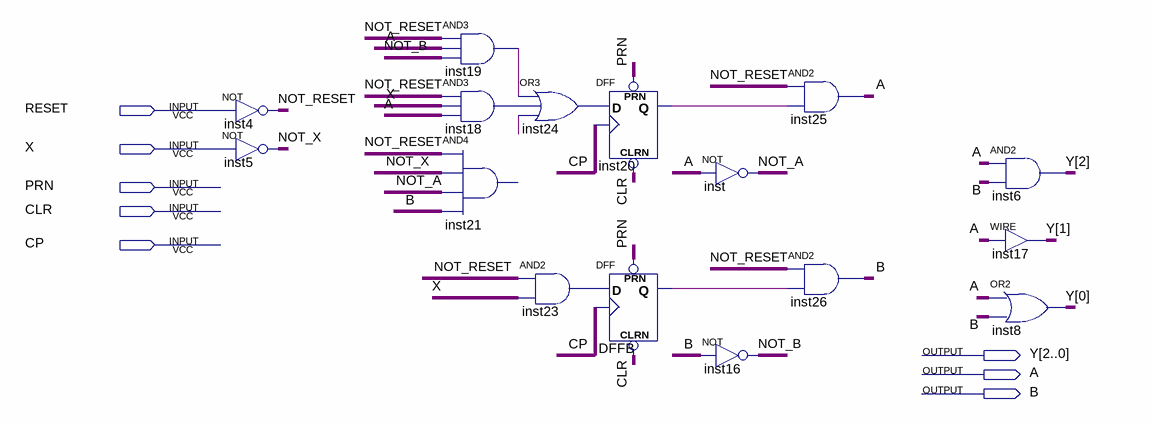
[diagram p0: schematic sheet]
// Quartus schematic Problem1.bdf as structural Verilog: 16 symbols, 8 pins
module Problem1 (
  input  RESET,
  input  X,
  input  PRN,
  input  CLR,
  input  CP,
  output [2:0] Y,
  output A,
  output B
);

  wire DFFB_q, inst18_out, inst19_out, inst20_q, inst23_out, inst24_out, NOT_A, NOT_B, NOT_RESET, NOT_X,
       undriven;

  not inst4 (NOT_RESET, RESET);
  not inst5 (NOT_X, X);
  and inst19 (inst19_out, NOT_RESET, A, NOT_B);
  and inst18 (inst18_out, NOT_RESET, X, A);
  // AND4 inst21 has open pins: IN1=NOT_RESET, IN2=NOT_X, IN3=NOT_A, IN4=B, OUT=open
  or inst24 (inst24_out, inst19_out, inst18_out, undriven);
  and inst23 (inst23_out, NOT_RESET, X);
  DFF inst20 (.CLRN(CLR), .CLK(CP), .D(inst24_out), .PRN(PRN), .Q(inst20_q));
  DFF DFFB (.CLRN(CLR), .CLK(CP), .D(inst23_out), .PRN(PRN), .Q(DFFB_q));
  not inst (NOT_A, A);
  not inst16 (NOT_B, B);
  and inst25 (A, NOT_RESET, inst20_q);
  and inst26 (B, NOT_RESET, DFFB_q);
  and inst6 (Y[2], A, B);
  assign Y[1] = A;  // WIRE inst17
  or inst8 (Y[0], A, B);
endmodule
